# Altium schematic sheet Connectors — копия.SchDoc
size 420 x 297 mm
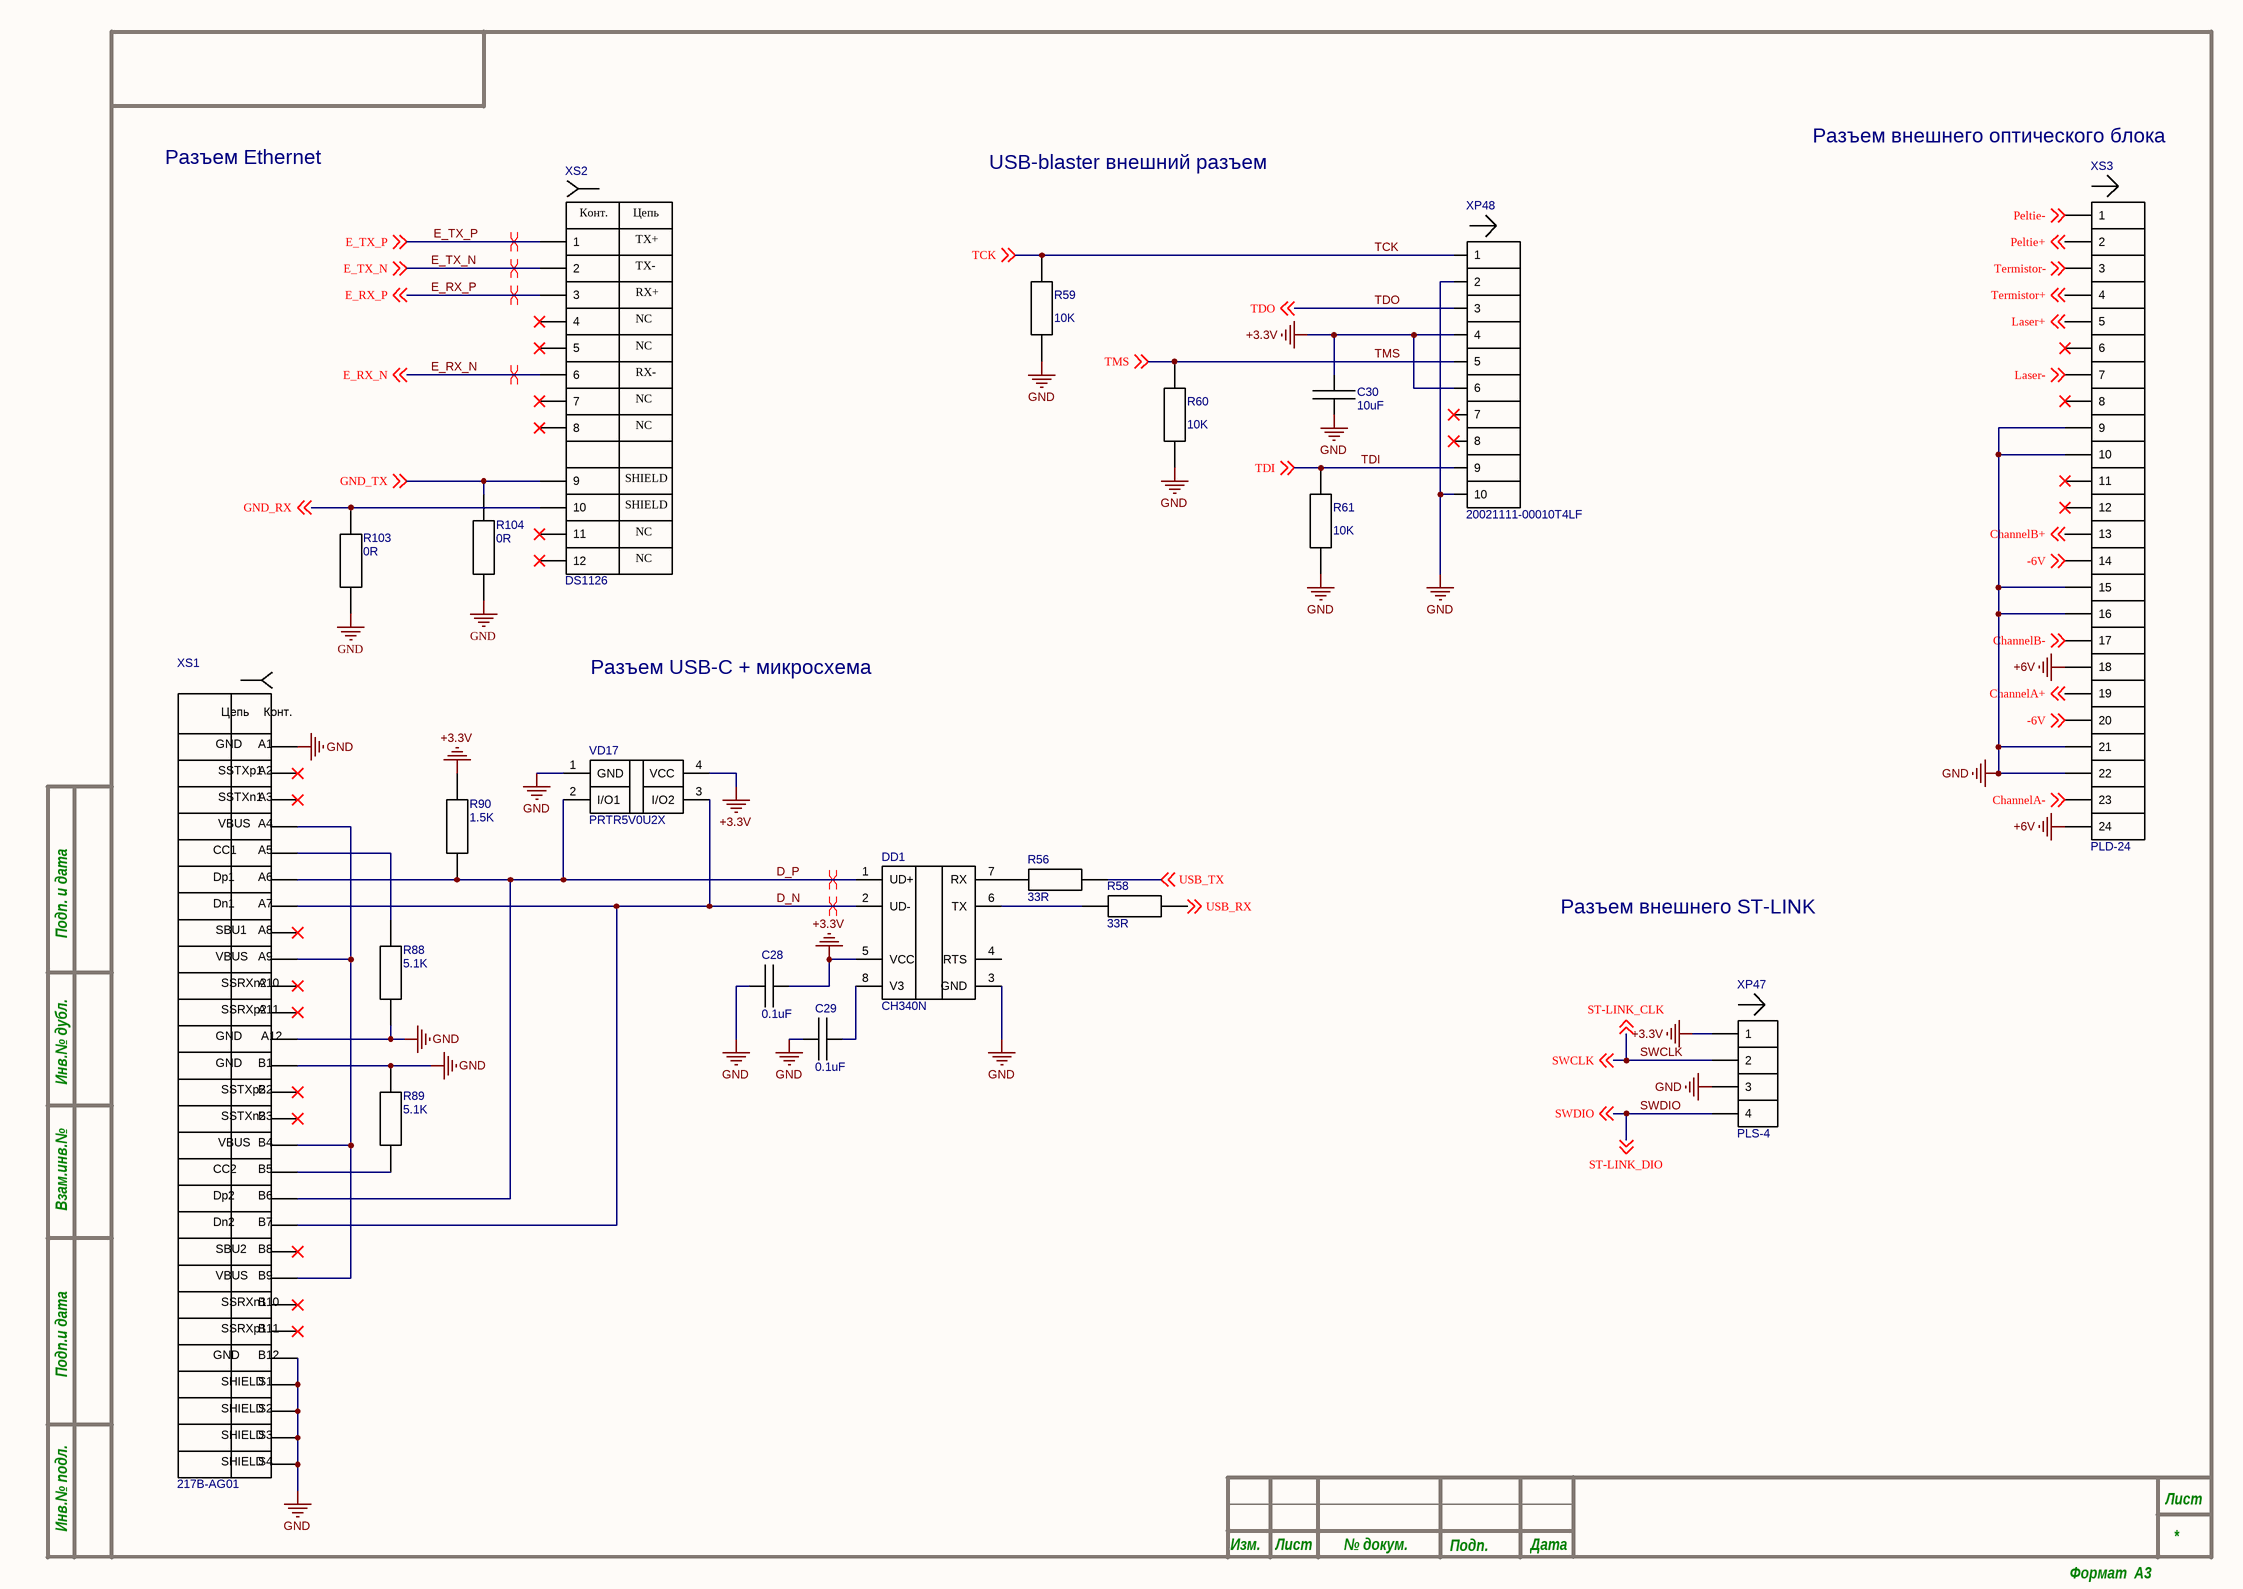
[diagram p0: Connectors — копия.SchDoc]

## Parts
C28  0.1uF  [0805C]
C29  0.1uF  [0805C]
C30  10uF  [0402C]
DD1  CH340N  [SOP8]
R56  33R  [R0402]
R58  33R  [R0402]
R59  10K  [R0402]
R60  10K  [R0402]
R61  10K  [R0402]
R88  5.1K  [R0402]
R89  5.1K  [R0402]
R90  1.5K  [R0402]
R103  0R  [R0402]
R104  0R  [R0402]
VD17  PRTR5V0U2X  [SOT143B]
XP47  PLS-4  [PLS-4]
XP48  20021111-00010T4LF  [20021111-00010T4LF]
XS1  217B-AG01  [217B-AG01]
XS2  DS1126  [DS1126]
XS3  PLD-24  [PLD-24]

## Nets
+3.3V: C28.2 C30.2 DD1.5(VCC) R90.2 VD17.4(VCC) XP47.1 XP48.4 XP48.6
+6V: XS3.18 XS3.24
GND: C28.1 C29.1 C30.1 DD1.3(GND) R59.1 R60.1 R61.1 R88.1 R89.2 R103.1 R104.1 VD17.1(GND) XP47.3 XP48.2 XP48.10 XS1.A1(GND) XS1.A12(GND) XS1.B1(GND) XS1.B12(GND) XS1.S1(SHIELD) XS1.S2(SHIELD) XS1.S3(SHIELD) XS1.S4(SHIELD) XS3.9 XS3.10 XS3.15 XS3.16 XS3.21 XS3.22
-6V: XS3.14 XS3.20 ; off-sheet -6V
ChannelA+: XS3.19 ; off-sheet ChannelA+
ChannelA-: XS3.23 ; off-sheet ChannelA-
ChannelB+: XS3.13 ; off-sheet ChannelB+
ChannelB-: XS3.17 ; off-sheet ChannelB-
D_N: DD1.2(UD-) VD17.3(I/O2) XS1.A7(Dn1) XS1.B7(Dn2)
D_P: DD1.1(UD+) R90.1 VD17.2(I/O1) XS1.A6(Dp1) XS1.B6(Dp2)
E_RX_N: XS2.6 ; off-sheet E_RX_N
E_RX_P: XS2.3 ; off-sheet E_RX_P
E_TX_N: XS2.2 ; off-sheet E_TX_N
E_TX_P: XS2.1 ; off-sheet E_TX_P
GND_RX: R103.2 XS2.10 ; off-sheet GND_RX
GND_TX: R104.2 XS2.9 ; off-sheet GND_TX
Laser+: XS3.5 ; off-sheet Laser+
Laser-: XS3.7 ; off-sheet Laser-
Peltie+: XS3.2 ; off-sheet Peltie+
Peltie-: XS3.1 ; off-sheet Peltie-
SWCLK: XP47.2 ; off-sheet ST-LINK_CLK, off-sheet SWCLK  [also labelled ST-LINK_CLK]
SWDIO: XP47.4 ; off-sheet ST-LINK_DIO, off-sheet SWDIO  [also labelled ST-LINK_DIO]
TCK: R59.2 XP48.1 ; off-sheet TCK
TDI: R61.2 XP48.9 ; off-sheet TDI
TDO: XP48.3 ; off-sheet TDO
Termistor+: XS3.4 ; off-sheet Termistor+
Termistor-: XS3.3 ; off-sheet Termistor-
TMS: R60.2 XP48.5 ; off-sheet TMS
USB_RX: R58.2 ; off-sheet USB_RX
USB_TX: R56.2 ; off-sheet USB_TX
NetC29_2: C29.2 DD1.8(V3)
NetDD1_6: DD1.6(TX) R58.1
NetDD1_7: DD1.7(RX) R56.1
NetR88_2: R88.2 XS1.A5(CC1)
NetR89_1: R89.1 XS1.B5(CC2)
NetXS1_A4: XS1.A4(VBUS) XS1.A9(VBUS) XS1.B4(VBUS) XS1.B9(VBUS)

Not connected (* = marked no-connect by the designer): DD1 4(RTS); XP48 7* 8*; XS1 A2(SSTXp1)* A3(SSTXn1)* A8(SBU1)* A10(SSRXn2)* A11(SSRXp2)* B2(SSTXp2)* B3(SSTXn2)* B8(SBU2)* B10(SSRXn1)* B11(SSRXp1)*; XS2 4* 5* 7* 8* 11* 12*; XS3 6* 8* 11* 12*

## Layout directives
differential pair: D_N, D_P, E_RX_N, E_RX_P, E_TX_N, E_TX_P

## Notes on the sheet
- Разъем Ethernet
- USB-blaster внешний разъем
- Разъем внешнего оптического блока
- Разъем USB-C + микросхема
- Разъем внешнего ST-LINK
- Подп. и дата
- Инв.№ дубл.
- Взам.инв.№
- Подп.и дата
- Инв.№ подл.
- Изм.
- Лист
- № докум.
- Подп.
- Дата
- Формат  A3
- (in symbol 217B-AG01) Цепь; Конт.
- (in symbol DS1126) Конт.; Цепь; TX+; TX-; RX+; NC; RX-; SHIELD

## Library data of the parts
C28 C29 = C0805-0.1UF 10% 50V: C0805 0.1UF 10% 50V; Part Number: SMD CAP CER 0.1UF ±10% 50V X7R 0805; Added_by: anton@teslatec.ru; Solder_Amount: 2; Pkg: 0805; Created_at: 10/01/2023; MountType: SMD; Mount: MOUNT
C30 = C0402-10UF 10% 10V: Part Number: SMD CAP CER 10UF ±10% 10V X5R 0402; Added_by: Rutel@Mail.ru; Solder_Amount: 2; Pkg: 0402; Created_at: 27/03/2020; MountType: SMD; Mount: MOUNT
DD1 = CH340N: USB to Serial Port Chip CH340, SOP-8; Added_by: irdolgopolowa@yandex.ru; Pkg: SOIC-8; Solder_Amount: 8; Created_at: 29/10/24; Mount: MOUNT; Part Number: CH340N; MountType: SMD
R56 R58 = R0402-33R: Resistor SMD 33R 1% 0402; Part Number: SMD RES 33R OHM 1% ±100ppm/°C 0402; Added_by: Rutel@teslatec.ru; Solder_Amount: 2; Pkg: 0402; Created_at: 21/04/2020; MountType: SMD; Mount: MOUNT
R59-R61 = R0402-10K: Resistor SMD 10K 1% 0402; Part Number: SMD RES 10 KOHM 1% ±100ppm/°C 0402; Added_by: Rutel@teslatec.ru; Solder_Amount: 2; Pkg: 0402; Created_at: 21/04/2020; MountType: SMD; Mount: MOUNT
R88 R89 = R0402-5.1K: Resistor SMD 5.1K 1% 0402; Part Number: SMD RES 5.1 KOHM 1% ±100ppm/°C 0402; Added_by: Rutel@teslatec.ru; Solder_Amount: 2; Pkg: 0402; Created_at: 21/04/2020; MountType: SMD; Mount: MOUNT
R90 = R0402-1.5K: Resistor SMD 1.5K 1% 0402; Part Number: SMD RES 1.5 KOHM 1% ±100ppm/°C 0402; Added_by: Rutel@teslatec.ru; Solder_Amount: 2; Pkg: 0402; Created_at: 21/04/2020; MountType: SMD; Mount: MOUNT
R103 R104 = R0402-0R: Resistor SMD 0R 1% 0402; Part Number: SMD RES 0R 0402; Added_by: irdolgopolowa@yandex.ru; Solder_Amount: 2; Pkg: 0402; Created_at: 29/10/24; MountType: SMD; Mount: MOUNT
VD17 = PRTR5V0U2X: PRTR5V0U2X, ESD(Rail-to-Rail), 1pF,  5V; Added_by: irdolgopolowa@yandex.ru; Pkg: SOT-143; Solder_Amount: 4; Created_at: 29/10/24; Mount: MOUNT; MountType: SMD; Part Number: PRTR5V0U2X
XP47 = PLS-4: HEADER 2.54mm; Mating Part: BLS-4; Added_by: irdolgopolowa@yandex.ru; Solder_Amount: 4; Mating Terminals: BL-T (DS-1071); Cable/Wire: МГТФ 0,35 кв.мм ГОСТ; Created_at: 29/10/24; Mount: MOUNT; MountType: THM; Part Number: PLS-4; Pkg: PLS-4
XP48 = 20021111-00010T4LF: 20021111-00010T4LF. pin 10; Added_by: irdolgopolowa@yandex.ru; Solder_Amount: 10; Created_at: 29/10/24; Mount: MOUNT; MountType: THM; Pkg: 20021111-00010T4LF; Part Number: 20021111-00010T4LF
XS1 = 217B-AG01: USB Type-C, Right Angle Hybrid Type, 30u"; Solder_Amount: 28; Added_by: ridel_av@teslatec.ru; MountType: SMD; Mount: MOUNT; Pkg: 217B-AG01; Part Number: 217B-AG01; Created_at: 13/12/2021
XS2 = DS1126: Ethernet PCB 8/8 RJ45; Added_by: irdolgopolowa@yandex.ru; Solder_Amount: 12; Pkg: RJ-45; Created_at: 29/10/24; Mount: MOUNT; MountType: THM; Part Number: DS1126
XS3 = PLD-24: Pin Header Pitch 2.54mm; Pkg: PLD-24 2.54mm; Solder_Amount: 24; Added_by: andrew@teslatec.ru; MountType: THM; Mount: MOUNT; Part Number: PLD-24; Mating Part: -; Mating Terminals: -; Cable/Wire: -; Created_at: 1/09/2020